# EAGLE schematic midi2cv (EAGLE 9.0.1)
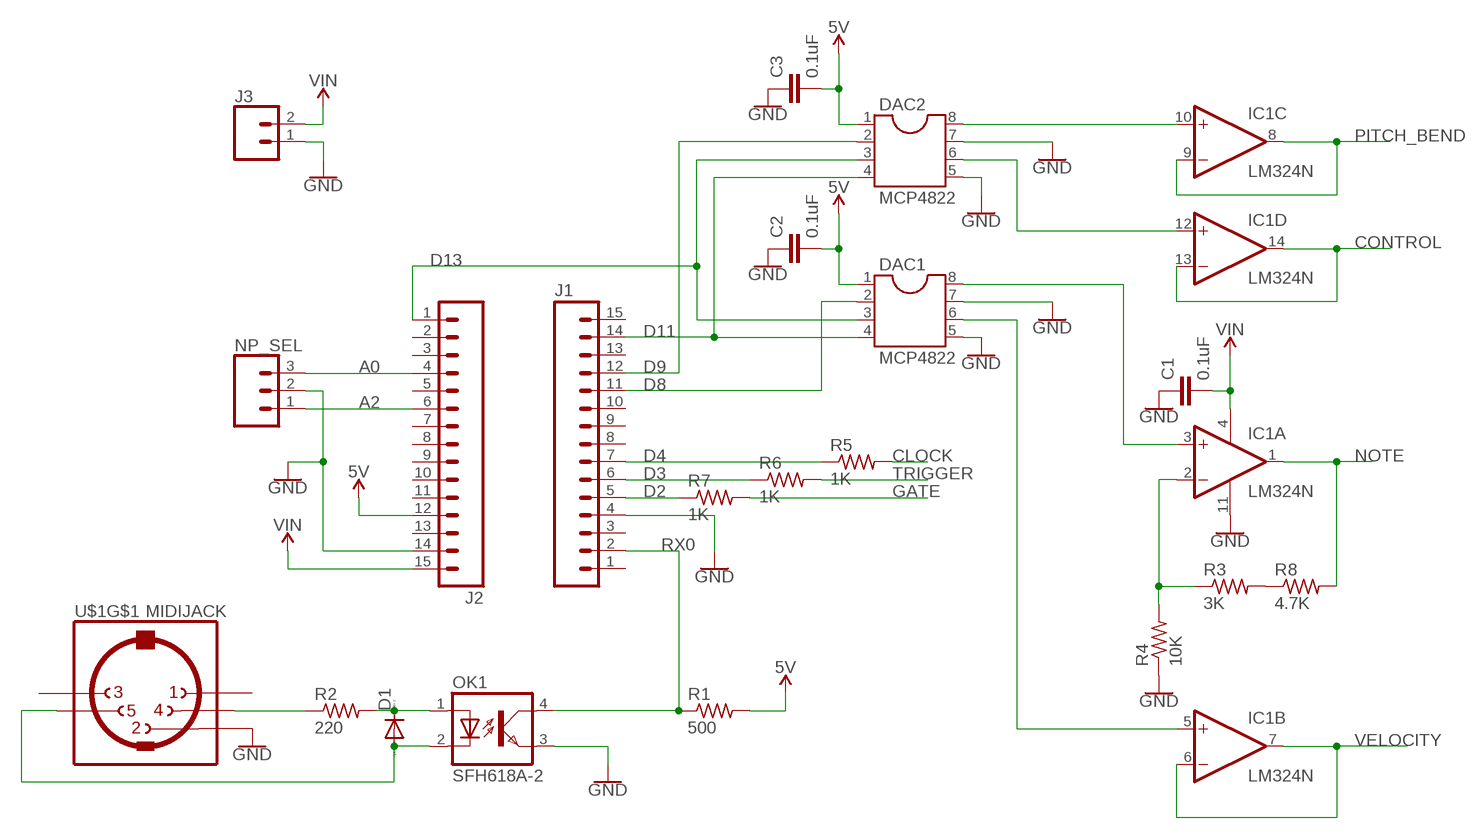
[diagram p0: schematic, sheet 1]

## Parts
C1  0.1uF  0.1UF-KIT-EZ-50V-20%  [CAP-PTH-SMALL-KIT]
C2  0.1uF  0.1UF-KIT-EZ-50V-20%  [CAP-PTH-SMALL-KIT]
C3  0.1uF  0.1UF-KIT-EZ-50V-20%  [CAP-PTH-SMALL-KIT]
D1  DIODE-D-10  [D-10]
DAC1  MCP4822  DIL8S  [SOCKET-08]
DAC2  MCP4822  DIL8S  [SOCKET-08]
IC1  LM324N  [DIL14]
J1  M15  [1X15]
J2  M15  [1X15]
J3  CONN_025MM  [SCREWTERMINAL-5MM-2]
NP_SEL  CONN_03  [1X03]
OK1  SFH618A-2  [DIP4]
R1  500  R-US_0207/10  [0207/10]
R2  220  R-US_0207/10  [0207/10]
R3  3K  R-US_0207/10  [0207/10]
R4  10K  R-US_0207/10  [0207/10]
R5  1K  R-US_0207/10  [0207/10]
R6  1K  R-US_0207/10  [0207/10]
R7  1K  R-US_0207/10  [0207/10]
R8  4.7K  R-US_0207/10  [0207/10]
U$1  MIDIJACK  [CP-2350]

## Nets
5V: C2.2 C3.2 DAC1.1 DAC2.1 J2.12 R1.2
A0: J2.4 NP_SEL.3
A2: J2.6 NP_SEL.1
CLOCK: R5.2
CONTROL: IC1.13(D:-IN) IC1.14(D:OUT)
D2: J1.5 R7.1
D3: J1.6 R6.1
D4: J1.7 R5.1
D8: DAC1.2 J1.11
D9: DAC2.2 J1.12
D11: DAC1.4 DAC2.4 J1.14
D13: DAC1.3 DAC2.3 J2.1
GATE: R7.2
GND: C1.1 C2.1 C3.1 DAC1.5 DAC1.7 DAC2.5 DAC2.7 IC1.11(P:V-) J1.4 J2.14 J3.1 NP_SEL.2 OK1.3(EMIT) R4.1 U$1.2
N$1: D1.C OK1.1(A) R2.2
N$2: D1.A OK1.2(C) U$1.5
N$3: R2.1 U$1.4
N$4: DAC1.8 IC1.3(A:+IN)
N$5: R3.2 R8.1
N$6: IC1.2(A:-IN) R3.1 R4.2
N$7: DAC1.6 IC1.5(B:+IN)
N$8: DAC2.8 IC1.10(C:+IN)
N$9: DAC2.6 IC1.12(D:+IN)
NOTE: IC1.1(A:OUT) R8.2
PITCH_BEND: IC1.8(C:OUT) IC1.9(C:-IN)
RX0: J1.2 OK1.4(COL) R1.1
TRIGGER: R6.2
VELOCITY: IC1.6(B:-IN) IC1.7(B:OUT)
VIN: C1.2 IC1.4(P:V+) J2.15 J3.2
Unconnected: J1.1 J1.3 J1.8 J1.9 J1.10 J1.13 J1.15 J2.2 J2.3 J2.5 J2.7 J2.8 J2.9 J2.10 J2.11 J2.13 U$1.1 U$1.3 U$1.PE1(MT) U$1.PE2(MT) U$1.PE(MT) U$1.PE@(MT)

## Library data of the parts
C1-C3 = SparkFun-Capacitors:0.1UF: 0.1µF ceramic capacitors A capacitor is a passive two-terminal electrical component used to store electrical energy temporarily in an electric field.; PROD_ID: CAP-08370
D1 = diode:DIODE-: DIODE
DAC1 DAC2 = ic-package:DIL8: Dual In Line / Socket
IC1 = linear:LM324: OP AMP
J1 J2 = SparkFun-Connectors:M15: Header 15 Standard 15-pin 0.1" header. Use with straight break away headers (SKU : PRT-00116), right angle break away headers (PRT-00553), swiss pins (PRT-00743), machine pins (PRT-00117), and female headers (PRT-00115).
J3 = SparkFun-Connectors:CONN_02: Multi connection point. Often used as Generic Header-pin footprint for 0.1 inch spaced/style header connections On any of the 0.1 inch spaced packages, you can populate with these: Break Away Headers - Straight <https://www.sparkfun.com/products/116> (PRT-00116) Break Away Male Headers - Right Angle <https://www.sparkfun.com/products/553> (PRT-00553) Female Headers <https://www.sparkfun.com/products/115> (PRT-00115) Break Away Headers - Machine Pin <https://www.sparkfun.com/products/117> (PRT-00117) Break Away Female Headers - Swiss Machine Pin <https://www.sparkfun.com/products/743> (PRT-00743) For SCREWTERMINALS and SPRING TERMINALS visit here: Screw Terimnals on SparkFun.com <https://www.sparkfun.com/search/results?term=Screw+Terminals> (5mm/3.5mm/2.54mm spacing) This device is also useful as a general connection point to wire up your design to another part of your project. Our various solder wires solder well into these plated through hole pads. Hook-Up Wire - Assortment (Stranded, 22 AWG) <https://www.sparkfun.com/products/11375> (PRT-11375) Hook-Up Wire - Assortment (Solid Core, 22 AWG) <https://www.sparkfun.com/products/11367> (PRT-11367) View the entire wire category on our website here <https://www.sparkfun.com/categories/141> Special notes: Molex polarized connector foot print use with: PRT-08233 with associated crimp pins and housings. 2.54_SCREWTERM for use with PRT-10571. 3.5mm Screw Terminal footprints for PRT-08084 5mm Screw Terminal footprints for use with PRT-08432; SF_SKU: PRT-08432
NP_SEL = SparkFun-Connectors:CONN_03: Multi connection point. Often used as Generic Header-pin footprint for 0.1 inch spaced/style header connections On any of the 0.1 inch spaced packages, you can populate with these: Break Away Headers - Straight <https://www.sparkfun.com/products/116> (PRT-00116) Break Away Male Headers - Right Angle <https://www.sparkfun.com/products/553> (PRT-00553) Female Headers <https://www.sparkfun.com/products/115> (PRT-00115) Break Away Headers - Machine Pin <https://www.sparkfun.com/products/117> (PRT-00117) Break Away Female Headers - Swiss Machine Pin <https://www.sparkfun.com/products/743> (PRT-00743) Stackable Header - 3 Pin (Female, 0.1") <https://www.sparkfun.com/products/13875> (PRT-13875) For SCREWTERMINALS and SPRING TERMINALS visit here: Screw Terimnals on SparkFun.com <https://www.sparkfun.com/search/results?term=Screw+Terminals> (5mm/3.5mm/2.54mm spacing) This device is also useful as a general connection point to wire up your design to another part of your project. Our various solder wires solder well into these plated through hole pads. Hook-Up Wire - Assortment (Stranded, 22 AWG) <https://www.sparkfun.com/products/11375> (PRT-11375) Hook-Up Wire - Assortment (Solid Core, 22 AWG) <https://www.sparkfun.com/products/11367> (PRT-11367) View the entire wire category on our website here <https://www.sparkfun.com/categories/141> Special notes: Molex polarized connector foot print use with SKU : PRT-08232 with associated crimp pins and housings.
OK1 = optocoupler:SFH618?*: Optocoupler, Phototransistor Output, Low Input Current Source: Data sheet <http://www.vishay.com/docs/83673/sfh618.pdf>; MF: VISHAY/TELEFUNKEN; MPN: SFH618A-2; OC_FARNELL: 6424855; OC_NEWARK: 21H7744
R1-R8 = resistor:R-US_: RESISTOR, American symbol
U$1 = adafruit:MIDIJACK: DIN 5 jack also known as MIDI jack A modification of conn-hirshman:MAB5SH with two options for the grounding 'teeth'